# EAGLE schematic vr61-revC (EAGLE 9.6.2)
CNAME: VR61 - MicroMod 60% Custom Keyboard PCB; CREVISION: Rev A

## Sheet 1 of 2
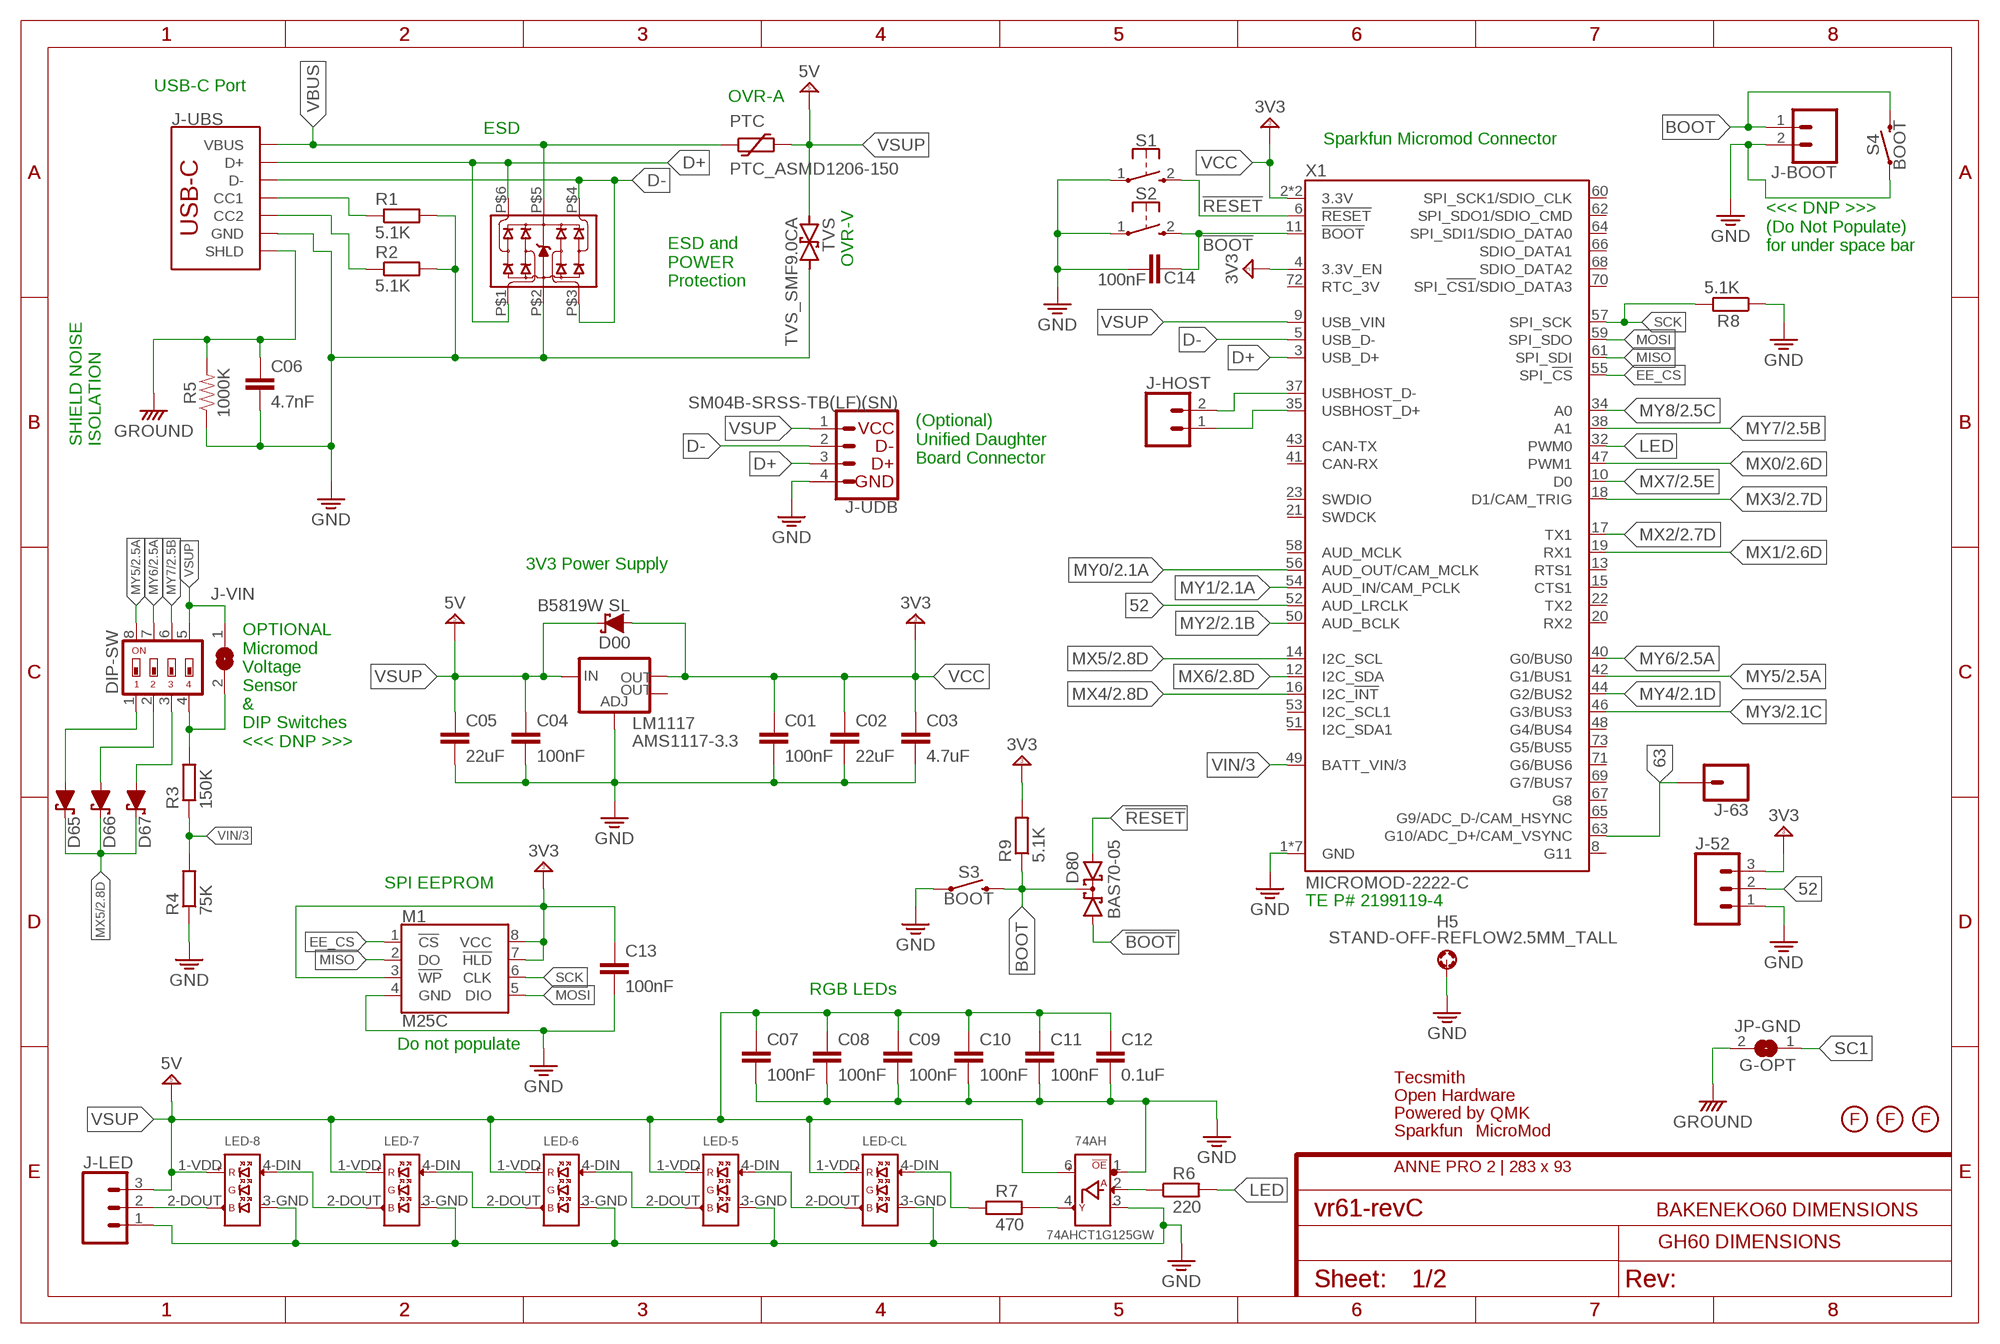
[diagram p0: schematic, sheet 1]

### Parts
74AH  74AHCT1G125GW  [SC-88A__TSSOP5__SOT353-1]
C01  100nF  0.1UF-0603-25V-5%  [0603]
C02  22uF  0.22UF-0603-25V-10%  [0603]
C03  4.7uF  1.0NF/1000PF-0603-50V-10%  [0603]
C04  100nF  0.1UF-0603-25V-5%  [0603]
C05  22uF  0.22UF-0603-25V-10%  [0603]
C06  4.7nF  0.1UF-0603-25V-5%  [0603]
C07  100nF  C-EUC0603  [C0603]
C08  100nF  C-EUC0603  [C0603]
C09  100nF  C-EUC0603  [C0603]
C10  100nF  C-EUC0603  [C0603]
C11  100nF  C-EUC0603  [C0603]
C12  0.1uF  C-EUC0603  [C0603]
C13  100nF  C-EUC0603  [C0603]
C14  100nF  C-EUC0603  [C0603]
D00  B5819W SL  1N5819WS  [SOD-123]
D65  1N5819WS  [SOD-123]
D66  1N5819WS  [SOD-123]
D67  1N5819WS  [SOD-123]
D80  BAS70-05  [SOT23]
DIP-SW  DIP004  [DIP-1.27-004]
ESD  ESD_SRV05-4  [SOT-23-6L]
FP_AP2  FOOTPRINT-AP2  [FOOTPRINT-AP2]
H5  STAND-OFF-REFLOW2.5MM_TALL  [STAND-OFF-REFLOW-M2.5]
J-52  CONN_03  [1X03]
J-63  CONN_01  [1X01]
J-BOOT  CONN_02  [1X02]
J-HOST  CONN_02  [1X02]
J-LED  CONN_03  [1X03]
J-UBS  USB_C_2-LAYER  [USB-C-16P]
J-UDB  SM04B-SRSS-TB(LF)(SN)  C3_UNIFIEDJS-1MM  [1X04_1MM_RA]
J-VIN  JUMPER-1X2  [SOLDERJUMPER_ARROW_NOPASTE]
JP-GND  G-OPT  JUMPER-1X2  [SOLDERJUMPER_ARROW_NOPASTE]
LED-5  SK6812-E-REVERSE  [SK6812-E-MILL]
LED-6  SK6812-E-REVERSE  [SK6812-E-MILL]
LED-7  SK6812-E-REVERSE  [SK6812-E-MILL]
LED-8  SK6812-E-REVERSE  [SK6812-E-MILL]
LED-CL  SK6812-E-REVERSE  [SK6812-E-MILL]
LM1117  AMS1117-3.3  V_REG_LM1117SOT223  [SOT223]
LOGO1  OSHW-LOGOL  [OSHW-LOGO-L]
M1  M25C  [8-SOIC]
PTC  PTC_ASMD1206-150  PTC_ASMD1206  [SMD_PTC]
R1  5.1K  R-EU_R0603  [R0603]
R2  5.1K  R-EU_R0603  [R0603]
R3  150K  R-EU_R0603  [R0603]
R4  75K  R-EU_R0603  [R0603]
R5  1000K  75KOHM-0603-1/10W-1%  [0603]
R6  220  R-EU_R0603  [R0603]
R7  470  R-EU_R0603  [R0603]
R8  5.1K  R-EU_R0603  [R0603]
R9  5.1K  R-EU_R0603  [R0603]
S1  MOMENTARY-SWITCH-SPST-1  [SKRKAEE020]
S2  MOMENTARY-SWITCH-SPST-1  [SKRKAEE020]
S3  BOOT  MOMENTARY-SWITCH-SPST-SMD-5.2-TALL-REDUNDANT  [TACTILE_SWITCH_SMD_5.2MM]
S4  BOOT  MOMENTARY-SWITCH-SPST-SMD-5.2-TALL-REDUNDANT  [TACTILE_SWITCH_SMD_5.2MM]
TVS  TVS_SMF9.0CA  [SOD123FL-BI]
U$3  MICROMOD-LOGO  [MICROMOD-LOGO]
U$5  SPARKFUN_LOGO0.2  [SFE_LOGO_NAME_FLAME_.2]
U$6  QMK_LOGO  [QMK_LOGO]
U$8  TECSMITH-LOGOLONG  [TECSMITH-NAME]
U$20  FIDUCIAL  [FIDUCIAL]
U$21  FIDUCIAL  [FIDUCIAL]
U$22  FIDUCIAL  [FIDUCIAL]
U$24  FOOTPRINT-BAKENEKO60  [FOOTPRINT-BAKENEKO60]
U$27  FOOTPRINT-DIMS-GH60  [FOOTPRINT-DIMS-GH60]
X1  MICROMOD-2222-C  [M.2-CONNECTOR-E]

### Nets
52: J-52.2 X1.52(AUD_LRCLK)
63: J-63.1 X1.63(G10/ADC_D+/CAM_VSYNC)
!BOOT: C14.1 D80.1(A1) S2.2 X1.11(!BOOT!)
!RESET: D80.2(A2) S1.2 X1.6(!RESET!)
BOOT: D80.3(C) J-BOOT.1 R9.1 S3.3 S3.4 S4.3 S4.4
CC1: J-UBS.A5(CC1) R1.1
CC2: J-UBS.B5(CC2) R2.1
D+: ESD.P$1 ESD.P$6 J-UBS.A6(D+) J-UBS.B6(D+) J-UDB.3(D+) X1.3(USB_D+)
D-: ESD.P$3 ESD.P$4 J-UBS.A7(D-) J-UBS.B7(D-) J-UDB.2(D-) X1.5(USB_D-)
EE_CS: M1.1(!CS) X1.55(SPI_!CS!)
GND: 74AH.1(!OE) 74AH.3(3_GND) C01.2 C02.2 C03.2 C04.2 C05.2 C06.2 C07.2 C08.2 C09.2 C10.2 C11.2 C12.2 C13.2 C14.2 ESD.P$2 H5.1 J-52.1 J-BOOT.2 J-LED.1 J-UBS.GND J-UBS.GND2(GND) J-UDB.4(GND) LED-5.3-GND(3_GND) LED-6.3-GND(3_GND) LED-7.3-GND(3_GND) LED-8.3-GND(3_GND) LED-CL.3-GND(3_GND) LM1117.1(ADJ) M1.4(GND) R1.2 R2.2 R4.1 R5.1 R8.1 S1.1 S2.1 S3.1 S3.2 S4.1 S4.2 TVS.P$2 X1.1(GND) X1.7(GND) X1.33(GND) X1.36(GND) X1.39(GND) X1.45(GND) X1.75(GND)
GROUND: C06.1 J-UBS.SHLD1(SHLD) J-UBS.SHLD2(SHLD) J-UBS.SHLD3(SHLD) J-UBS.SHLD4(SHLD) J-UBS.SHLD5(SHLD) J-UBS.SHLD6(SHLD) J-UBS.SHLD7(SHLD) J-UBS.SHLD8(SHLD) JP-GND.2 R5.2
LED: R6.2 X1.32(PWM0)
LED1ST: 74AH.2(A_DIN) R6.1
MISO: M1.2(DO) X1.61(SPI_SDI)
MOSI: M1.5(DIO) X1.59(SPI_SDO)
MX0: X1.47(PWM1) ; also sheet 2
MX1: X1.19(RX1) ; also sheet 2
MX2: X1.17(TX1) ; also sheet 2
MX3: X1.18(D1/CAM_TRIG) ; also sheet 2
MX4: X1.16(I2C_!INT!) ; also sheet 2
MX5: D65.C D66.C D67.C X1.14(I2C_SCL) ; also sheet 2
MX6: X1.12(I2C_SDA) ; also sheet 2
MX7: X1.10(D0) ; also sheet 2
MY0: X1.56(AUD_OUT/CAM_MCLK) ; also sheet 2
MY1: X1.54(AUD_IN/CAM_PCLK) ; also sheet 2
MY2: X1.50(AUD_BCLK) ; also sheet 2
MY3: X1.46(G3/BUS3) ; also sheet 2
MY4: X1.44(G2/BUS2) ; also sheet 2
MY5: DIP-SW.8 X1.42(G1/BUS1) ; also sheet 2
MY6: DIP-SW.7 X1.40(G0/BUS0) ; also sheet 2
MY7: DIP-SW.6 X1.38(A1) ; also sheet 2
MY8: X1.34(A0) ; also sheet 2
N$29: LED-5.4-DIN(4_DIN) LED-CL.2-DOUT(2_DOUT)
N$63: LED-5.2-DOUT(2_DOUT) LED-6.4-DIN(4_DIN)
N$64: LED-6.2-DOUT(2_DOUT) LED-7.4-DIN(4_DIN)
N$65: LED-7.2-DOUT(2_DOUT) LED-8.4-DIN(4_DIN)
N$66: 74AH.4(Y_DOUT) R7.2
N$67: LED-CL.4-DIN(4_DIN) R7.1
N$72: J-LED.2 LED-8.2-DOUT(2_DOUT)
N$73: D65.A DIP-SW.1
N$74: DIP-SW.4 J-VIN.2 R3.2
N$75: D66.A DIP-SW.2
N$76: D67.A DIP-SW.3
SC1: JP-GND.1
SCK: M1.6(CLK) R8.2 X1.57(SPI_SCK)
USBHOST_D+: J-HOST.1 X1.35(USBHOST_D+)
USBHOST_D-: J-HOST.2 X1.37(USBHOST_D-)
VBUS: ESD.P$5 J-UBS.VBUS1(VBUS) J-UBS.VBUS2(VBUS) PTC.P$1
VCC: C01.1 C02.1 C03.1 C13.1 D00.A J-52.3 LM1117.2(OUT) M1.3(!WP) M1.7(!HLD) M1.8(VCC) R9.2 X1.2(3.3V) X1.4(3.3V_EN) X1.74(3.3V) ; supply symbol labelled 3V3
VIN/3: R3.1 R4.2 X1.49(BATT_VIN/3)
VSUP: 74AH.6(5_VCC) C04.1 C05.1 C07.1 C08.1 C09.1 C10.1 C11.1 C12.1 D00.C DIP-SW.5 J-LED.3 J-UDB.1(VCC) J-VIN.1 LED-5.1-VDD(1_VDD) LED-6.1-VDD(1_VDD) LED-7.1-VDD(1_VDD) LED-8.1-VDD(1_VDD) LED-CL.1-VDD(1_VDD) LM1117.3(IN) PTC.P$2 TVS.P$1 X1.9(USB_VIN) ; supply symbol labelled 5V
Unconnected: LM1117.4(OUT) X1.8(G11) X1.13(RTS1) X1.15(CTS1) X1.20(RX2) X1.21(SWDCK) X1.22(TX2) X1.23(SWDIO) X1.41(CAN-RX) X1.43(CAN-TX) X1.48(G4/BUS4) X1.51(I2C_SDA1) X1.53(I2C_SCL1) X1.58(AUD_MCLK) X1.60(SPI_SCK1/SDIO_CLK) X1.62(SPI_SDO1/SDIO_CMD) X1.64(SPI_SDI1/SDIO_DATA0) X1.65(G9/ADC_D-/CAM_HSYNC) X1.66(SDIO_DATA1) X1.67(G8) X1.68(SDIO_DATA2) X1.69(G7/BUS7) X1.70(SPI_!CS1!/SDIO_DATA3) X1.71(G6/BUS6) X1.72(RTC_3V) X1.73(G5/BUS5)

### Notes on the sheet
- USB-C Port
- OVR-A
- ESD
- Sparkfun Micromod Connector
- OVR-V
- <<< DNP >>>
  (Do Not Populate)
  for under space bar
- ESD and
  POWER
  Protection
- SHIELD NOISE
  ISOLATION
- (Optional)
  Unified Daughter
  Board Connector
- 3V3 Power Supply
- OPTIONAL
  Micromod
  Voltage
  Sensor
  &
  DIP Switches
  <<< DNP >>>
- SPI EEPROM
- TE P# 2199119-4
- RGB LEDs
- Do not populate

## Sheet 2 of 2
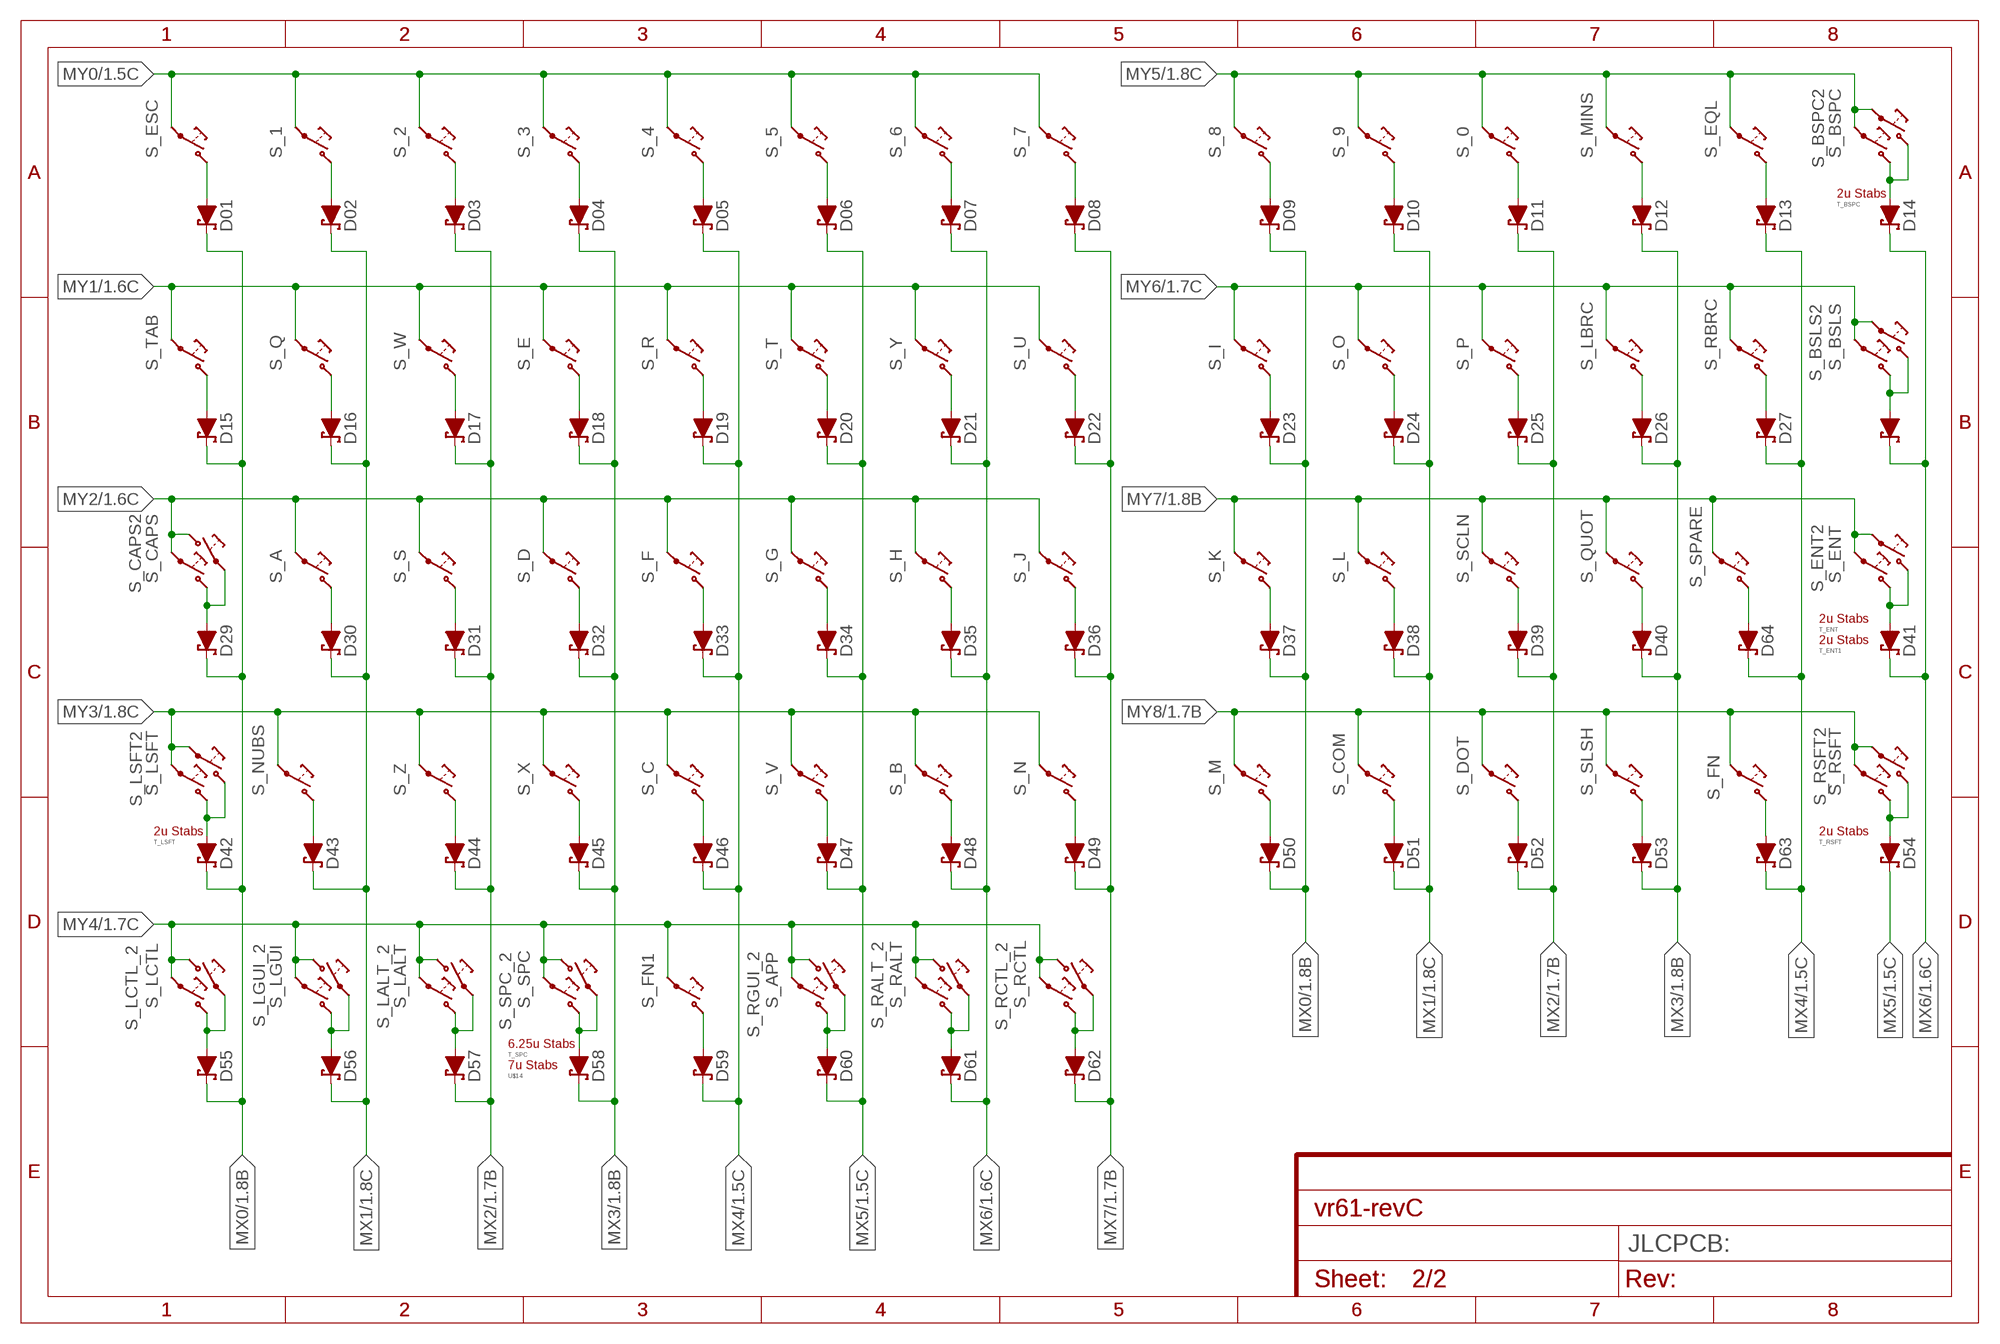
[diagram p1: schematic, sheet 2]

### Parts
D01  1N5819WS  [SOD-123]
D02  1N5819WS  [SOD-123]
D03  1N5819WS  [SOD-123]
D04  1N5819WS  [SOD-123]
D05  1N5819WS  [SOD-123]
D06  1N5819WS  [SOD-123]
D07  1N5819WS  [SOD-123]
D08  1N5819WS  [SOD-123]
D09  1N5819WS  [SOD-123]
D10  1N5819WS  [SOD-123]
D11  1N5819WS  [SOD-123]
D12  1N5819WS  [SOD-123]
D13  1N5819WS  [SOD-123]
D14  1N5819WS  [SOD-123]
D15  1N5819WS  [SOD-123]
D16  1N5819WS  [SOD-123]
D17  1N5819WS  [SOD-123]
D18  1N5819WS  [SOD-123]
D19  1N5819WS  [SOD-123]
D20  1N5819WS  [SOD-123]
D21  1N5819WS  [SOD-123]
D22  1N5819WS  [SOD-123]
D23  1N5819WS  [SOD-123]
D24  1N5819WS  [SOD-123]
D25  1N5819WS  [SOD-123]
D26  1N5819WS  [SOD-123]
D27  1N5819WS  [SOD-123]
D28  1N5819WS  [SOD-123]
D29  1N5819WS  [SOD-123]
D30  1N5819WS  [SOD-123]
D31  1N5819WS  [SOD-123]
D32  1N5819WS  [SOD-123]
D33  1N5819WS  [SOD-123]
D34  1N5819WS  [SOD-123]
D35  1N5819WS  [SOD-123]
D36  1N5819WS  [SOD-123]
D37  1N5819WS  [SOD-123]
D38  1N5819WS  [SOD-123]
D39  1N5819WS  [SOD-123]
D40  1N5819WS  [SOD-123]
D41  1N5819WS  [SOD-123]
D42  1N5819WS  [SOD-123]
D43  1N5819WS  [SOD-123]
D44  1N5819WS  [SOD-123]
D45  1N5819WS  [SOD-123]
D46  1N5819WS  [SOD-123]
D47  1N5819WS  [SOD-123]
D48  1N5819WS  [SOD-123]
D49  1N5819WS  [SOD-123]
D50  1N5819WS  [SOD-123]
D51  1N5819WS  [SOD-123]
D52  1N5819WS  [SOD-123]
D53  1N5819WS  [SOD-123]
D54  1N5819WS  [SOD-123]
D55  1N5819WS  [SOD-123]
D56  1N5819WS  [SOD-123]
D57  1N5819WS  [SOD-123]
D58  1N5819WS  [SOD-123]
D59  1N5819WS  [SOD-123]
D60  1N5819WS  [SOD-123]
D61  1N5819WS  [SOD-123]
D62  1N5819WS  [SOD-123]
D63  1N5819WS  [SOD-123]
D64  1N5819WS  [SOD-123]
S_0  MX-5-PIN-HOTSWAP-VIA  [MX-5-PIN-HOTSWAP-VIA]
S_1  MX-5-PIN-HOTSWAP-VIA  [MX-5-PIN-HOTSWAP-VIA]
S_2  MX-5-PIN-HOTSWAP-VIA  [MX-5-PIN-HOTSWAP-VIA]
S_3  MX-5-PIN-HOTSWAP-VIA  [MX-5-PIN-HOTSWAP-VIA]
S_4  MX-5-PIN-HOTSWAP-VIA  [MX-5-PIN-HOTSWAP-VIA]
S_5  MX-5-PIN-HOTSWAP-VIA  [MX-5-PIN-HOTSWAP-VIA]
S_6  MX-5-PIN-HOTSWAP-VIA  [MX-5-PIN-HOTSWAP-VIA]
S_7  MX-5-PIN-HOTSWAP-VIA  [MX-5-PIN-HOTSWAP-VIA]
S_8  MX-5-PIN-HOTSWAP-VIA  [MX-5-PIN-HOTSWAP-VIA]
S_9  MX-5-PIN-HOTSWAP-VIA  [MX-5-PIN-HOTSWAP-VIA]
S_A  MX-5-PIN-HOTSWAP-VIA  [MX-5-PIN-HOTSWAP-VIA]
S_APP  MX-5-PIN-HOTSWAP-VIA  [MX-5-PIN-HOTSWAP-VIA]
S_B  MX-5-PIN-HOTSWAP-VIA  [MX-5-PIN-HOTSWAP-VIA]
S_BSLS  MX-5-PIN-HOTSWAP-VIA  [MX-5-PIN-HOTSWAP-VIA]
S_BSLS2  MX-5-PIN-HOTSWAP-VIANO-SILK  [MX-5-PIN-HOTSWAP-VIA-NS]
S_BSPC  MX-5-PIN-HOTSWAP-VIA  [MX-5-PIN-HOTSWAP-VIA]
S_BSPC2  MX-5-PIN-HOTSWAP-VIANO-SILK  [MX-5-PIN-HOTSWAP-VIA-NS]
S_C  MX-5-PIN-HOTSWAP-VIA  [MX-5-PIN-HOTSWAP-VIA]
S_CAPS  MX-5-PIN-HOTSWAP-VIA  [MX-5-PIN-HOTSWAP-VIA]
S_CAPS2  MX-5-PIN-MILMAX-3305-XNO-SILK  [MX-5-PIN-MILMAX-3305-X-NS]
S_COM  MX-5-PIN-HOTSWAP-VIA  [MX-5-PIN-HOTSWAP-VIA]
S_D  MX-5-PIN-HOTSWAP-VIA  [MX-5-PIN-HOTSWAP-VIA]
S_DOT  MX-5-PIN-HOTSWAP-VIA  [MX-5-PIN-HOTSWAP-VIA]
S_E  MX-5-PIN-HOTSWAP-VIA  [MX-5-PIN-HOTSWAP-VIA]
S_ENT  MX-5-PIN-HOTSWAP-VIA  [MX-5-PIN-HOTSWAP-VIA]
S_ENT2  MX-5-PIN-HOTSWAP-VIANO-SILK  [MX-5-PIN-HOTSWAP-VIA-NS]
S_EQL  MX-5-PIN-HOTSWAP-VIA  [MX-5-PIN-HOTSWAP-VIA]
S_ESC  MX-5-PIN-HOTSWAP-VIA  [MX-5-PIN-HOTSWAP-VIA]
S_F  MX-5-PIN-HOTSWAP-VIA  [MX-5-PIN-HOTSWAP-VIA]
S_FN  MX-5-PIN-HOTSWAP-VIANO-SILK  [MX-5-PIN-HOTSWAP-VIA-NS]
S_FN1  MX-5-PIN-HOTSWAP-VIA  [MX-5-PIN-HOTSWAP-VIA]
S_G  MX-5-PIN-HOTSWAP-VIA  [MX-5-PIN-HOTSWAP-VIA]
S_H  MX-5-PIN-HOTSWAP-VIA  [MX-5-PIN-HOTSWAP-VIA]
S_I  MX-5-PIN-HOTSWAP-VIA  [MX-5-PIN-HOTSWAP-VIA]
S_J  MX-5-PIN-HOTSWAP-VIA  [MX-5-PIN-HOTSWAP-VIA]
S_K  MX-5-PIN-HOTSWAP-VIA  [MX-5-PIN-HOTSWAP-VIA]
S_L  MX-5-PIN-HOTSWAP-VIA  [MX-5-PIN-HOTSWAP-VIA]
S_LALT  MX-5-PIN-HOTSWAP-VIA  [MX-5-PIN-HOTSWAP-VIA]
S_LALT_2  MX-5-PIN-HOTSWAP-VIANO-SILK  [MX-5-PIN-HOTSWAP-VIA-NS]
S_LBRC  MX-5-PIN-HOTSWAP-VIA  [MX-5-PIN-HOTSWAP-VIA]
S_LCTL  MX-5-PIN-HOTSWAP-VIA  [MX-5-PIN-HOTSWAP-VIA]
S_LCTL_2  MX-5-PIN-HOTSWAP-VIANO-SILK  [MX-5-PIN-HOTSWAP-VIA-NS]
S_LGUI  MX-5-PIN-HOTSWAP-VIA  [MX-5-PIN-HOTSWAP-VIA]
S_LGUI_2  MX-5-PIN-HOTSWAP-VIANO-SILK  [MX-5-PIN-HOTSWAP-VIA-NS]
S_LSFT  MX-5-PIN-HOTSWAP-VIA  [MX-5-PIN-HOTSWAP-VIA]
S_LSFT2  MX-5-PIN-HOTSWAP-VIANO-SILK  [MX-5-PIN-HOTSWAP-VIA-NS]
S_M  MX-5-PIN-HOTSWAP-VIA  [MX-5-PIN-HOTSWAP-VIA]
S_MINS  MX-5-PIN-HOTSWAP-VIA  [MX-5-PIN-HOTSWAP-VIA]
S_N  MX-5-PIN-HOTSWAP-VIA  [MX-5-PIN-HOTSWAP-VIA]
S_NUBS  MX-5-PIN-HOTSWAP-VIANO-SILK  [MX-5-PIN-HOTSWAP-VIA-NS]
S_O  MX-5-PIN-HOTSWAP-VIA  [MX-5-PIN-HOTSWAP-VIA]
S_P  MX-5-PIN-HOTSWAP-VIA  [MX-5-PIN-HOTSWAP-VIA]
S_Q  MX-5-PIN-HOTSWAP-VIA  [MX-5-PIN-HOTSWAP-VIA]
S_QUOT  MX-5-PIN-HOTSWAP-VIA  [MX-5-PIN-HOTSWAP-VIA]
S_R  MX-5-PIN-HOTSWAP-VIA  [MX-5-PIN-HOTSWAP-VIA]
S_RALT  MX-5-PIN-HOTSWAP-VIA  [MX-5-PIN-HOTSWAP-VIA]
S_RALT_2  MX-5-PIN-HOTSWAP-VIANO-SILK  [MX-5-PIN-HOTSWAP-VIA-NS]
S_RBRC  MX-5-PIN-HOTSWAP-VIA  [MX-5-PIN-HOTSWAP-VIA]
S_RCTL  MX-5-PIN-HOTSWAP-VIA  [MX-5-PIN-HOTSWAP-VIA]
S_RCTL_2  MX-5-PIN-HOTSWAP-VIANO-SILK  [MX-5-PIN-HOTSWAP-VIA-NS]
S_RGUI_2  MX-5-PIN-HOTSWAP-VIANO-SILK  [MX-5-PIN-HOTSWAP-VIA-NS]
S_RSFT  MX-5-PIN-HOTSWAP-VIA  [MX-5-PIN-HOTSWAP-VIA]
S_RSFT2  MX-5-PIN-HOTSWAP-VIANO-SILK  [MX-5-PIN-HOTSWAP-VIA-NS]
S_S  MX-5-PIN-HOTSWAP-VIA  [MX-5-PIN-HOTSWAP-VIA]
S_SCLN  MX-5-PIN-HOTSWAP-VIA  [MX-5-PIN-HOTSWAP-VIA]
S_SLSH  MX-5-PIN-HOTSWAP-VIA  [MX-5-PIN-HOTSWAP-VIA]
S_SPARE  MX-5-PIN-HOTSWAP-VIANO-SILK  [MX-5-PIN-HOTSWAP-VIA-NS]
S_SPC  MX-5-PIN-HOTSWAP-VIA  [MX-5-PIN-HOTSWAP-VIA]
S_SPC_2  MX-5-PIN-HOTSWAP-VIANO-SILK  [MX-5-PIN-HOTSWAP-VIA-NS]
S_T  MX-5-PIN-HOTSWAP-VIA  [MX-5-PIN-HOTSWAP-VIA]
S_TAB  MX-5-PIN-HOTSWAP-VIA  [MX-5-PIN-HOTSWAP-VIA]
S_U  MX-5-PIN-HOTSWAP-VIA  [MX-5-PIN-HOTSWAP-VIA]
S_V  MX-5-PIN-HOTSWAP-VIA  [MX-5-PIN-HOTSWAP-VIA]
S_W  MX-5-PIN-HOTSWAP-VIA  [MX-5-PIN-HOTSWAP-VIA]
S_X  MX-5-PIN-HOTSWAP-VIA  [MX-5-PIN-HOTSWAP-VIA]
S_Y  MX-5-PIN-HOTSWAP-VIA  [MX-5-PIN-HOTSWAP-VIA]
S_Z  MX-5-PIN-HOTSWAP-VIA  [MX-5-PIN-HOTSWAP-VIA]
T_BSPC  MX-STABS-200U  [MX-STABS-200U]
T_ENT  MX-STABS-200U  [MX-STABS-200U]
T_ENT1  MX-STABS-200U  [MX-STABS-200U]
T_LSFT  MX-STABS-200U  [MX-STABS-200U]
T_RSFT  MX-STABS-200U  [MX-STABS-200U]
T_SPC  MX-STABS-625U  [MX-STABS-625U]
U$14  MX-STABS-700U  [MX-STABS-700U]
U$26  ?  JLC_ORDER_NUMBER_QRQR_5X5  [JLC_ORDER_NUMBER_QR_5X5]

### Nets
MX0: D01.C D09.C D15.C D23.C D29.C D37.C D42.C D50.C D55.C ; also sheet 1
MX1: D02.C D10.C D16.C D24.C D30.C D38.C D43.C D51.C D56.C ; also sheet 1
MX2: D03.C D11.C D17.C D25.C D31.C D39.C D44.C D52.C D57.C ; also sheet 1
MX3: D04.C D12.C D18.C D26.C D32.C D40.C D45.C D53.C D58.C ; also sheet 1
MX4: D05.C D13.C D19.C D27.C D33.C D46.C D59.C D63.C D64.C ; also sheet 1
MX5: D06.C D20.C D34.C D47.C D54.C D60.C ; also sheet 1
MX6: D07.C D14.C D21.C D28.C D35.C D41.C D48.C D61.C ; also sheet 1
MX7: D08.C D22.C D36.C D49.C D62.C ; also sheet 1
MY0: S_1.2@1 S_1.2@2 S_2.2@1 S_2.2@2 S_3.2@1 S_3.2@2 S_4.2@1 S_4.2@2 S_5.2@1 S_5.2@2 S_6.2@1 S_6.2@2 S_7.2@1 S_7.2@2 S_ESC.2@1 S_ESC.2@2 ; also sheet 1
MY1: S_E.2@1 S_E.2@2 S_Q.2@1 S_Q.2@2 S_R.2@1 S_R.2@2 S_T.2@1 S_T.2@2 S_TAB.2@1 S_TAB.2@2 S_U.2@1 S_U.2@2 S_W.2@1 S_W.2@2 S_Y.2@1 S_Y.2@2 ; also sheet 1
MY2: S_A.2@1 S_A.2@2 S_CAPS2.1 S_CAPS.2@1 S_CAPS.2@2 S_D.2@1 S_D.2@2 S_F.2@1 S_F.2@2 S_G.2@1 S_G.2@2 S_H.2@1 S_H.2@2 S_J.2@1 S_J.2@2 S_S.2@1 S_S.2@2 ; also sheet 1
MY3: S_B.2@1 S_B.2@2 S_C.2@1 S_C.2@2 S_LSFT2.2@1 S_LSFT2.2@2 S_LSFT.2@1 S_LSFT.2@2 S_N.2@1 S_N.2@2 S_NUBS.2@1 S_NUBS.2@2 S_V.2@1 S_V.2@2 S_X.2@1 S_X.2@2 S_Z.2@1 S_Z.2@2 ; also sheet 1
MY4: S_APP.2@1 S_APP.2@2 S_FN1.2@1 S_FN1.2@2 S_LALT.2@1 S_LALT.2@2 S_LALT_2.1@1 S_LALT_2.1@2 S_LCTL.2@1 S_LCTL.2@2 S_LCTL_2.1@1 S_LCTL_2.1@2 S_LGUI.2@1 S_LGUI.2@2 S_LGUI_2.1@1 S_LGUI_2.1@2 S_RALT.2@1 S_RALT.2@2 S_RALT_2.1@1 S_RALT_2.1@2 S_RCTL.2@1 S_RCTL.2@2 S_RCTL_2.1@1 S_RCTL_2.1@2 S_RGUI_2.1@1 S_RGUI_2.1@2 S_SPC.2@1 S_SPC.2@2 S_SPC_2.1@1 S_SPC_2.1@2 ; also sheet 1
MY5: S_0.2@1 S_0.2@2 S_8.2@1 S_8.2@2 S_9.2@1 S_9.2@2 S_BSPC2.2@1 S_BSPC2.2@2 S_BSPC.2@1 S_BSPC.2@2 S_EQL.2@1 S_EQL.2@2 S_MINS.2@1 S_MINS.2@2 ; also sheet 1
MY6: S_BSLS2.2@1 S_BSLS2.2@2 S_BSLS.2@1 S_BSLS.2@2 S_I.2@1 S_I.2@2 S_LBRC.2@1 S_LBRC.2@2 S_O.2@1 S_O.2@2 S_P.2@1 S_P.2@2 S_RBRC.2@1 S_RBRC.2@2 ; also sheet 1
MY7: S_ENT2.2@1 S_ENT2.2@2 S_ENT.2@1 S_ENT.2@2 S_K.2@1 S_K.2@2 S_L.2@1 S_L.2@2 S_QUOT.2@1 S_QUOT.2@2 S_SCLN.2@1 S_SCLN.2@2 S_SPARE.2@1 S_SPARE.2@2 ; also sheet 1
MY8: S_COM.2@1 S_COM.2@2 S_DOT.2@1 S_DOT.2@2 S_FN.2@1 S_FN.2@2 S_M.2@1 S_M.2@2 S_RSFT2.2@1 S_RSFT2.2@2 S_RSFT.2@1 S_RSFT.2@2 S_SLSH.2@1 S_SLSH.2@2 ; also sheet 1
N$1: D01.A S_ESC.1@1 S_ESC.1@2
N$2: D02.A S_1.1@1 S_1.1@2
N$3: D03.A S_2.1@1 S_2.1@2
N$4: D04.A S_3.1@1 S_3.1@2
N$5: D05.A S_4.1@1 S_4.1@2
N$6: D06.A S_5.1@1 S_5.1@2
N$7: D07.A S_6.1@1 S_6.1@2
N$8: D08.A S_7.1@1 S_7.1@2
N$9: D09.A S_8.1@1 S_8.1@2
N$10: D10.A S_9.1@1 S_9.1@2
N$11: D11.A S_0.1@1 S_0.1@2
N$12: D12.A S_MINS.1@1 S_MINS.1@2
N$13: D13.A S_EQL.1@1 S_EQL.1@2
N$14: D14.A S_BSPC2.1@1 S_BSPC2.1@2 S_BSPC.1@1 S_BSPC.1@2
N$15: D15.A S_TAB.1@1 S_TAB.1@2
N$16: D16.A S_Q.1@1 S_Q.1@2
N$17: D17.A S_W.1@1 S_W.1@2
N$18: D18.A S_E.1@1 S_E.1@2
N$19: D19.A S_R.1@1 S_R.1@2
N$20: D20.A S_T.1@1 S_T.1@2
N$21: D21.A S_Y.1@1 S_Y.1@2
N$22: D22.A S_U.1@1 S_U.1@2
N$23: D23.A S_I.1@1 S_I.1@2
N$24: D24.A S_O.1@1 S_O.1@2
N$25: D25.A S_P.1@1 S_P.1@2
N$26: D26.A S_LBRC.1@1 S_LBRC.1@2
N$27: D27.A S_RBRC.1@1 S_RBRC.1@2
N$28: D28.A S_BSLS2.1@1 S_BSLS2.1@2 S_BSLS.1@1 S_BSLS.1@2
N$30: D30.A S_A.1@1 S_A.1@2
N$31: D31.A S_S.1@1 S_S.1@2
N$32: D32.A S_D.1@1 S_D.1@2
N$33: D33.A S_F.1@1 S_F.1@2
N$34: D34.A S_G.1@1 S_G.1@2
N$35: D35.A S_H.1@1 S_H.1@2
N$36: D36.A S_J.1@1 S_J.1@2
N$37: D37.A S_K.1@1 S_K.1@2
N$38: D38.A S_L.1@1 S_L.1@2
N$39: D39.A S_SCLN.1@1 S_SCLN.1@2
N$40: D40.A S_QUOT.1@1 S_QUOT.1@2
N$41: D41.A S_ENT2.1@1 S_ENT2.1@2 S_ENT.1@1 S_ENT.1@2
N$42: D42.A S_LSFT2.1@1 S_LSFT2.1@2 S_LSFT.1@1 S_LSFT.1@2
N$43: D44.A S_Z.1@1 S_Z.1@2
N$44: D45.A S_X.1@1 S_X.1@2
N$45: D46.A S_C.1@1 S_C.1@2
N$46: D47.A S_V.1@1 S_V.1@2
N$47: D48.A S_B.1@1 S_B.1@2
N$48: D49.A S_N.1@1 S_N.1@2
N$49: D50.A S_M.1@1 S_M.1@2
N$50: D51.A S_COM.1@1 S_COM.1@2
N$51: D52.A S_DOT.1@1 S_DOT.1@2
N$52: D53.A S_SLSH.1@1 S_SLSH.1@2
N$53: D54.A S_RSFT2.1@1 S_RSFT2.1@2 S_RSFT.1@1 S_RSFT.1@2
N$54: D55.A S_LCTL.1@1 S_LCTL.1@2 S_LCTL_2.2@1 S_LCTL_2.2@2
N$55: D56.A S_LGUI.1@1 S_LGUI.1@2 S_LGUI_2.2@1 S_LGUI_2.2@2
N$56: D57.A S_LALT.1@1 S_LALT.1@2 S_LALT_2.2@1 S_LALT_2.2@2
N$57: D58.A S_SPC.1@1 S_SPC.1@2 S_SPC_2.2@1 S_SPC_2.2@2
N$58: D59.A S_FN1.1@1 S_FN1.1@2
N$59: D60.A S_APP.1@1 S_APP.1@2 S_RGUI_2.2@1 S_RGUI_2.2@2
N$60: D61.A S_RALT.1@1 S_RALT.1@2 S_RALT_2.2@1 S_RALT_2.2@2
N$61: D62.A S_RCTL.1@1 S_RCTL.1@2 S_RCTL_2.2@1 S_RCTL_2.2@2
N$62: D29.A S_CAPS2.2 S_CAPS.1@1 S_CAPS.1@2
N$69: D43.A S_NUBS.1@1 S_NUBS.1@2
N$70: D64.A S_SPARE.1@1 S_SPARE.1@2
N$71: D63.A S_FN.1@1 S_FN.1@2

## Library data of the parts
74AH = ts_keyboards:74AHCT1G125GW
C01 C04 C06 = SparkFun-Capacitors:0.1UF: 0.1µF ceramic capacitors A capacitor is a passive two-terminal electrical component used to store electrical energy temporarily in an electric field.; PROD_ID: CAP-08604; VALUE: 0.1uF
C02 C05 = SparkFun-Capacitors:0.22UF: 0.22µF ceramic capacitors A capacitor is a passive two-terminal electrical component used to store electrical energy temporarily in an electric field.; PROD_ID: CAP-07822; VALUE: 0.22uF
C03 = SparkFun-Capacitors:1.0NF/1000PF: 1nF/1,000pF ceramic capacitors A capacitor is a passive two-terminal electrical component used to store electrical energy temporarily in an electric field.; PROD_ID: CAP-07886; VALUE: 1nF
C07-C09 C10-C14 = rcl:C-EU: CAPACITOR, European symbol; SPICEPREFIX: C
D00 D01-D09 D10-D67 = jlcpcb_basic_parts:1N5819WS: JLCPCB Part # C8598 Description 40V 600mV@1A 1A SOD-123 Schottky Barrier Diodes (SBD) ROHS Schottky Diode
D80 = diode:BAS70-05: Silicon Schottky Diodes General-purpose diode for high-speed switching
DIP-SW = untitled:DIP004
ESD = ts_keyboards:ESD_SRV05-4
FP_AP2 = ts_keyboards:FOOTPRINT-AP2
H5 = SparkFun-Hardware:STAND-OFF-REFLOW: Stand Off Reflow Compatible A metal standoff that can be placed and reflowed onto a PCB.; PROD_ID: HW-14899
J-52 J-LED = SparkFun-Connectors:CONN_03: Multi connection point. Often used as Generic Header-pin footprint for 0.1 inch spaced/style header connections On any of the 0.1 inch spaced packages, you can populate with these: Break Away Headers - Straight <https://www.sparkfun.com/products/116> (PRT-00116) Break Away Male Headers - Right Angle <https://www.sparkfun.com/products/553> (PRT-00553) Female Headers <https://www.sparkfun.com/products/115> (PRT-00115) Break Away Headers - Machine Pin <https://www.sparkfun.com/products/117> (PRT-00117) Break Away Female Headers - Swiss Machine Pin <https://www.sparkfun.com/products/743> (PRT-00743) Stackable Header - 3 Pin (Female, 0.1") <https://www.sparkfun.com/products/13875> (PRT-13875) For SCREWTERMINALS and SPRING TERMINALS visit here: Screw Terimnals on SparkFun.com <https://www.sparkfun.com/search/results?term=Screw+Terminals> (5mm/3.5mm/2.54mm spacing) This device is also useful as a general connection point to wire up your design to another part of your project. Our various solder wires solder well into these plated through hole pads. Hook-Up Wire - Assortment (Stranded, 22 AWG) <https://www.sparkfun.com/products/11375> (PRT-11375) Hook-Up Wire - Assortment (Solid Core, 22 AWG) <https://www.sparkfun.com/products/11367> (PRT-11367) View the entire wire category on our website here <https://www.sparkfun.com/categories/141> Special notes: Molex polarized connector foot print use with SKU : PRT-08232 with associated crimp pins and housings.
J-63 = SparkFun-Connectors:CONN_01: Single connection point. Often used as Generic Header-pin footprint for 0.1 inch spaced/style header connections On any of the 0.1 inch spaced packages, you can populate with these: Break Away Headers - Straight <https://www.sparkfun.com/products/116> (PRT-00116) Break Away Male Headers - Right Angle <https://www.sparkfun.com/products/553> (PRT-00553) Female Headers <https://www.sparkfun.com/products/115> (PRT-00115) Break Away Headers - Machine Pin <https://www.sparkfun.com/products/117> (PRT-00117) Break Away Female Headers - Swiss Machine Pin <https://www.sparkfun.com/products/743> (PRT-00743) This device is also useful as a general connection point to wire up your design to another part of your project. Our various solder wires solder well into these plated through hole pads. Hook-Up Wire - Assortment (Stranded, 22 AWG) <https://www.sparkfun.com/products/11375> (PRT-11375) Hook-Up Wire - Assortment (Solid Core, 22 AWG) <https://www.sparkfun.com/products/11367> (PRT-11367) View the entire wire category on our website here <https://www.sparkfun.com/categories/141> Special notes: SMTSO-256-ET is a "flush mount" nut for a 4-40 screw. We mostly use this on specialty testbeds; it is a nice way to connect hardware to your PCB at an adjustable hieght. Also note, the SNAP packages are for using a snappable style connector. We sell a baggie of snaps and they are also used on two LilyPad designs: Snap Assortment - 30 pack (male and female) <https://www.sparkfun.com/products/11347> (DEV-11347) LilyPad Arduino SimpleSnap <https://www.sparkfun.com/products/10941> (DEV-10941) LilyPad SimpleSnap Protoboard <https://www.sparkfun.com/products/10940> (DEV-10940)
J-BOOT J-HOST = SparkFun-Connectors:CONN_02: Multi connection point. Often used as Generic Header-pin footprint for 0.1 inch spaced/style header connections On any of the 0.1 inch spaced packages, you can populate with these: Break Away Headers - Straight <https://www.sparkfun.com/products/116> (PRT-00116) Break Away Male Headers - Right Angle <https://www.sparkfun.com/products/553> (PRT-00553) Female Headers <https://www.sparkfun.com/products/115> (PRT-00115) Break Away Headers - Machine Pin <https://www.sparkfun.com/products/117> (PRT-00117) Break Away Female Headers - Swiss Machine Pin <https://www.sparkfun.com/products/743> (PRT-00743) For SCREWTERMINALS and SPRING TERMINALS visit here: Screw Terimnals on SparkFun.com <https://www.sparkfun.com/search/results?term=Screw+Terminals> (5mm/3.5mm/2.54mm spacing) This device is also useful as a general connection point to wire up your design to another part of your project. Our various solder wires solder well into these plated through hole pads. Hook-Up Wire - Assortment (Stranded, 22 AWG) <https://www.sparkfun.com/products/11375> (PRT-11375) Hook-Up Wire - Assortment (Solid Core, 22 AWG) <https://www.sparkfun.com/products/11367> (PRT-11367) View the entire wire category on our website here <https://www.sparkfun.com/categories/141> Special notes: Molex polarized connector foot print use with: PRT-08233 with associated crimp pins and housings. 2.54_SCREWTERM for use with PRT-10571. 3.5mm Screw Terminal footprints for PRT-08084 5mm Screw Terminal footprints for use with PRT-08432
J-UBS = __untitled:USB_C: USB Type C 16Pin Connector Super Speed pins not available on the 16-pin purely SMD connector so this part is best for USB 2.0 implementations. D1 and D2 are tied together enabling D+/- no matter which way the cable is plugged into the connector. The two channel configuration pins (CC1/2) are exposed. These are normally connected to ground via 5.1k resistors but can be reconfigured for high current/high power applications.; PROD_ID: CONN-14122
J-UDB = __untitled:C3_UNIFIED: SparkFun I2C Standard Qwiic Connector An SMD 1mm pitch JST connector makes it easy and quick (get it? Qwiic?) to connect I2C devices to each other. The Qwiic system <http://www.sparkfun.com/qwiic> enables fast and solderless connection between popular platforms and various sensors and actuators. We carry 200mm <https://www.sparkfun.com/products/14204>, 100mm <https://www.sparkfun.com/products/14205>, 50mm <https://www.sparkfun.com/products/14206>, and breadboard friendly <https://www.sparkfun.com/products/14207> Qwiic cables. We also offer 10 pcs strips <https://www.sparkfun.com/products/14323> the SMD connectors.
J-VIN JP-GND = ts_jumpers:JUMPER-1X2: SMD Solder JUMPER Solder the two pads together to create a connection, or remove the solder to break it. REFLOW - Use this footprint for solder paste and reflow ovens. CLOSED - Has a trace between the two pads to ensure it is closed by default. The trace needs to be cut to disable the jumper, and can be closed again by creating a solder bridge between the two pads.; BOM: EXCLUDE
LED-5-LED-8 LED-CL = ts_keyboards:SK6812-E-REVERSE
LM1117 = SparkFun-IC-Power:V_REG_LM1117: Voltage Regulator LM1117 Standard adjustable voltage regulator but in SMD form. Spark Fun Electronics SKU : COM-00595; PROD_ID: VREG-08170
LOGO1 = random_logos:OSHW-LOGO: Open-Source Hardware (OSHW) Logo This logo indicates the piece of hardware it is found on incorporates a OSHW license and/or adheres to the definition of open source hardware found here: http://freedomdefined.org/OSHW
M1 = __untitled:M25C
PTC = ts_keyboards:PTC_ASMD1206
R1-R4 R6-R9 = rcl:R-EU_: RESISTOR, European symbol; SPICEPREFIX: R
R5 = SparkFun-Resistors:75KOHM: 75Ω resistor A resistor is a passive two-terminal electrical component that implements electrical resistance as a circuit element. Resistors act to reduce current flow, and, at the same time, act to lower voltage levels within circuits. - Wikipedia; PROD_ID: RES-09737; VALUE: 75
S1 S2 = VinoRodrigues_Custom_Eagle:MOMENTARY-SWITCH-SPST-1: Momentary Switch (Pushbutton) - SPST - Two Circuits Normally-open (NO) SPST momentary switches (buttons, pushbuttons). Schematic symbol includes two switch circuits. Variants SMD-4.6MMX2.8MM - 4.60mm x 2.80mm Tactile Momentary Button Switch - Used on SparkFun SAMD21 Mini Breakout <https://www.sparkfun.com/products/13664> SMD-5.2MM - Mini Pushbutton Switch - SMD <https://www.sparkfun.com/products/8720> - Used on Arduino Pro Mini <https://www.sparkfun.com/products/11114>
S3 S4 = SparkFun-Switches:MOMENTARY-SWITCH-SPST: Momentary Switch (Pushbutton) - SPST Normally-open (NO) SPST momentary switches (buttons, pushbuttons). Variants PTH-12MM - 12mm square, through-hole Momentary Pushbutton Switch - 12mm Square <https://www.sparkfun.com/products/9190> (COM-09190) PTH-6.0MM, PTH-6.0MM-KIT - 6.0mm square, through-hole Mini Pushbutton Switch <https://www.sparkfun.com/products/97> (COM-00097) KIT package intended for soldering kit's - only one side of pads' copper is exposed. PTH-RIGHT-ANGLE-KIT - Right-angle, through-hole Right Angle Tactile Button <https://www.sparkfun.com/products/10791> - Used on SparkFun BigTime Watch Kit <https://www.sparkfun.com/products/11734> SMD-12MM - 12mm square, surface-mount Tactile Button - SMD (12mm) <https://www.sparkfun.com/products/12993> (COM-12993) Used on SparkFun PicoBoard <https://www.sparkfun.com/products/11888> SMD-4.5MM - 4.5mm Square Trackball Switch Used on SparkFun Blackberry Trackballer Breakout <https://www.sparkfun.com/products/13169> SMD-4.6MMX2.8MM - 4.60mm x 2.80mm, surface mount Used on SparkFun SAMD21 Mini Breakout <https://www.sparkfun.com/products/13664> SMD-5.2MM, SMD-5.2-REDUNDANT - 5.2mm square, surface-mount Mini Pushbutton Switch - SMD <https://www.sparkfun.com/products/8720> (COM-08720) Used on Arduino Pro Mini <https://www.sparkfun.com/products/11114> REDUNDANT package connects both switch circuits together SMD-6.0X3.5MM - 6.0 x 3.5mm, surface mount Momentary Reset Switch SMD <https://www.sparkfun.com/products/8229> (COM-08229) SMD-6.2MM-TALL - 6.2mm square, surface mount Tactile Button - SMD (6mm) <https://www.sparkfun.com/products/12992> Used on SparkFun Digital Sandbox <https://www.sparkfun.com/products/12651> SMD-RIGHT-ANGLE - Right-angle, surface mount Used on SparkFun Block for Intel® Edison - Arduino <https://www.sparkfun.com/products/13036>; PROD_ID: SWCH-14139
S_0 S_1-S_9 S_A S_APP S_B S_BSLS S_BSLS2 S_BSPC S_BSPC2 S_C S_CAPS S_COM S_D S_DOT S_E S_ENT S_ENT2 S_EQL S_ESC S_F S_FN S_FN1 S_G S_H S_I S_J S_K S_L S_LALT S_LALT_2 S_LBRC S_LCTL S_LCTL_2 S_LGUI S_LGUI_2 S_LSFT S_LSFT2 S_M S_MINS S_N S_NUBS S_O S_P S_Q S_QUOT S_R S_RALT S_RALT_2 S_RBRC S_RCTL S_RCTL_2 S_RGUI_2 S_RSFT S_RSFT2 S_S S_SCLN S_SLSH S_SPARE S_SPC S_SPC_2 S_T S_TAB S_U S_V S_W S_X S_Y S_Z = tecsmith_keyboards:MX-5-PIN-HOTSWAP-VIA
S_CAPS2 = tecsmith_keyboards:MX-5-PIN-MILMAX-3305-X
T_BSPC T_ENT T_ENT1 T_LSFT T_RSFT = ts_keyboards:MX-STABS-200U
T_SPC = ts_keyboards:MX-STABS-625U
TVS = ts_keyboards:TVS_SMF9.0CA
U$3 = random_logos:MICROMOD-LOGO
U$5 = random_logos:SPARKFUN_LOGO
U$6 = random_logos:QMK_LOGO
U$8 = random_logos:TECSMITH-LOGO
U$14 = tecsmith_keyboards:MX-STABS-700U
U$20-U$22 = __temp_to_delete:FIDUCIAL
U$24 = ts_keyboards:FOOTPRINT-BAKENEKO60
U$26 = tecsmith_jlcpcb_ordering:JLC_ORDER_NUMBER_QR
U$27 = tecsmith_keyboards:FOOTPRINT-DIMS-GH60
X1 = SparkFun-MicroMod:MICROMOD: MicroMod Connector Description: A card edge connector and mating PCB connector to allow various MicroMod Processor Boards to be coupled with various carrier boards of different capabilities. Based on the M.2 standard.; PROD_ID: CONN-14877

## Net classes
0 default: width 0 mm, drill 0 mm